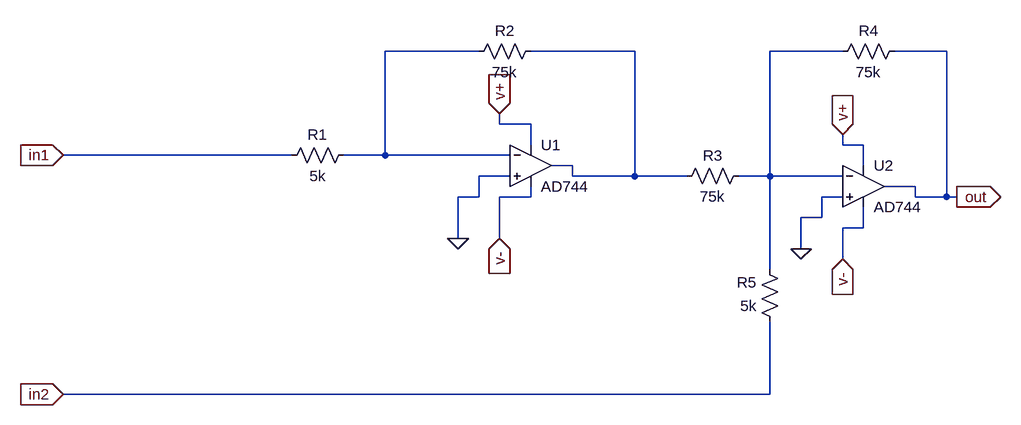
[diagram p0: schematic etj1.asc]
etj1.asc, the LTspice schematic file:
Version 4
SHEET 1 1168 680
WIRE 336 -128 192 -128
WIRE 576 -128 416 -128
WIRE 896 -128 784 -128
WIRE 1056 -128 976 -128
WIRE 368 -16 368 -32
WIRE 416 -16 368 -16
WIRE 416 16 416 -16
WIRE 896 16 896 0
WIRE 928 16 896 16
WIRE 48 32 -304 32
WIRE 192 32 192 -128
WIRE 192 32 128 32
WIRE 384 32 192 32
WIRE 480 48 448 48
WIRE 928 48 928 16
WIRE 384 64 336 64
WIRE 480 64 480 48
WIRE 576 64 576 -128
WIRE 576 64 480 64
WIRE 656 64 576 64
WIRE 784 64 784 -128
WIRE 784 64 736 64
WIRE 896 64 784 64
WIRE 1008 80 960 80
WIRE 336 96 336 64
WIRE 336 96 304 96
WIRE 416 96 416 80
WIRE 416 96 368 96
WIRE 896 96 864 96
WIRE 1008 96 1008 80
WIRE 1056 96 1056 -128
WIRE 1056 96 1008 96
WIRE 1072 96 1056 96
WIRE 864 128 864 96
WIRE 864 128 832 128
WIRE 928 144 928 112
WIRE 928 144 896 144
WIRE 304 160 304 96
WIRE 368 160 368 96
WIRE 832 176 832 128
WIRE 896 192 896 144
WIRE 784 208 784 64
WIRE 784 400 784 288
WIRE 784 400 -304 400
FLAG 304 160 0
FLAG 832 176 0
FLAG 368 -32 v+
IOPIN 368 -32 In
FLAG 896 0 v+
IOPIN 896 0 In
FLAG 368 160 v-
IOPIN 368 160 In
FLAG 896 192 v-
IOPIN 896 192 In
FLAG 1072 96 out
IOPIN 1072 96 Out
FLAG -304 32 in1
IOPIN -304 32 In
FLAG -304 400 in2
IOPIN -304 400 In
SYMBOL res 144 16 R90
WINDOW 0 0 56 VBottom 2
WINDOW 3 32 56 VTop 2
SYMATTR InstName R1
SYMATTR Value 5k
SYMBOL res 432 -144 R90
WINDOW 0 0 56 VBottom 2
WINDOW 3 32 56 VTop 2
SYMATTR InstName R2
SYMATTR Value 75k
SYMBOL res 752 48 R90
WINDOW 0 0 56 VBottom 2
WINDOW 3 32 56 VTop 2
SYMATTR InstName R3
SYMATTR Value 75k
SYMBOL res 992 -144 R90
WINDOW 0 0 56 VBottom 2
WINDOW 3 32 56 VTop 2
SYMATTR InstName R4
SYMATTR Value 75k
SYMBOL res 800 304 R180
WINDOW 0 36 76 Left 2
WINDOW 3 36 40 Left 2
SYMATTR InstName R5
SYMATTR Value 5k
SYMBOL OpAmps\\AD744 416 -16 R0
SYMATTR InstName U1
SYMBOL OpAmps\\AD744 928 16 R0
SYMATTR InstName U2

The netlist it stands for:
* etj1.asc
R1 N001 in1 5k
R2 N002 N001 75k
R3 N003 N002 75k
R4 out N003 75k
R5 in2 N003 5k
XU1 0 N001 v+ v- N002 AD744  ; pins In+ In- V+ V- OUT
XU2 0 N003 v+ v- out AD744  ; pins In+ In- V+ V- OUT
.backanno
.end